# Altium schematic sheet Programming_Pins.SchDoc
size A4; SheetNumber: 5; SheetTotal: 8
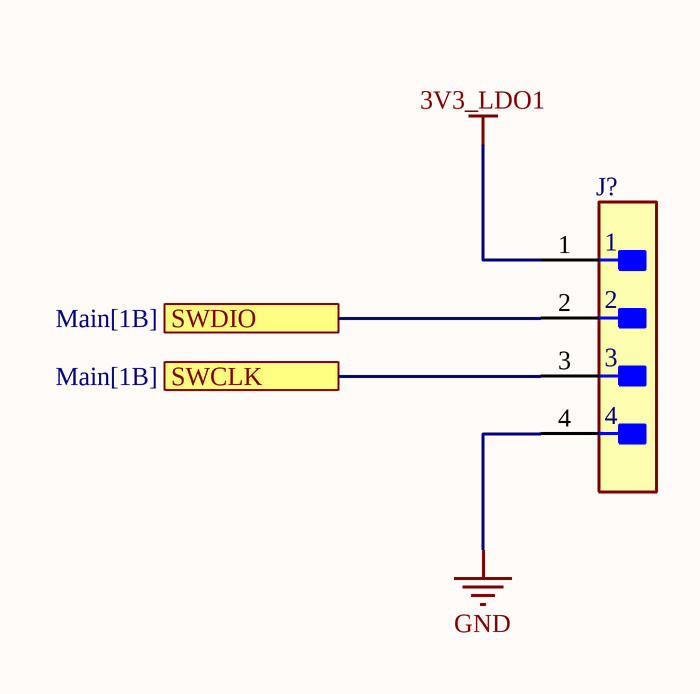
[diagram p0: Programming_Pins.SchDoc]

## Parts
J?  HTSW-104-07-G-S  [FP-HTSW-104-07-G-S-MFG]  (value not drawn)

## Ports
SWCLK (see Main[1B]), SWDIO (see Main[1B])

## Nets
3V3_LDO1: J?.1
GND: J?.4
SWCLK: J?.3 ; port SWCLK
SWDIO: J?.2 ; port SWDIO

## Library data of the parts
J? = CMP-02766-001776-1: CONN HEADER VERT 4POS 2.54MM; Gender: Male; Number of Contacts: 4; Packaging: Bulk; RoHS Compliant: Yes; Number of Rows: 1; Mount: Through Hole; Contact Material: Bronze; Series: HTSW; Radiation Hardening: No; Pitch: 2.54mm; Reach SVHC Compliant: Yes; Contact Plating: Gold; Termination: Through Hole